# Altium project candy-f1c100s.PrjPcb
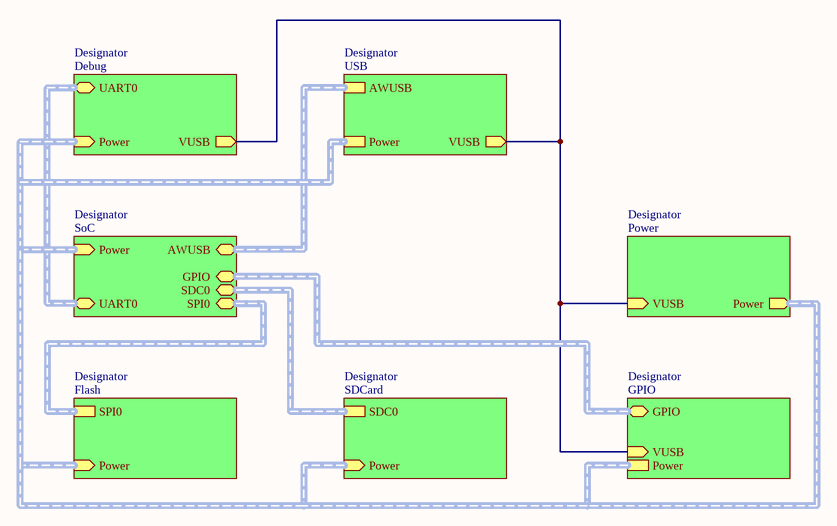
[diagram p0: top.SchDoc]
8 sheets, 96 parts. Net scope: hierarchical (ports join the sheet entries above them; power ports are global).
Board files: candy.PcbDoc, candy-v1.0-product.PcbDoc
Sheets:
  top.SchDoc
    Designator = soc.SchDoc
    Designator = power.SchDoc
    Designator = usb.SchDoc
    Designator = flash.SchDoc
    Designator = sdcard.SchDoc
    Designator = gpio.SchDoc
    Designator = debug.SchDoc

## Sheet top.SchDoc
size A4; SheetNumber: 1; SheetTotal: 8

### Sub-sheets
Designator = SoC: SDC0 (bidir, harness SDC0), SPI0 (bidir, harness SPI0), AWUSB (bidir, harness AWUSB), Power (in, harness Power), GPIO (bidir), UART0 (bidir)
Designator = Power: Power (out, harness Power), VUSB (in)
Designator = USB: AWUSB (harness AWUSB), VUSB (out), Power
Designator = Flash: SPI0 (harness SPI0), Power (in, harness Power)
Designator = SDCard: SDC0 (harness SDC0), Power (in, harness Power)
Designator = GPIO: GPIO (bidir), Power (harness Power), VUSB (in)
Designator = Debug: Power (in), UART0 (bidir), VUSB (out)

### Nets
5V: sheet Designator/VUSB, sheet Designator/VUSB, sheet Designator/VUSB, sheet Designator/VUSB

## Sheet soc.SchDoc
size A3; SheetNumber: 2; SheetTotal: 8
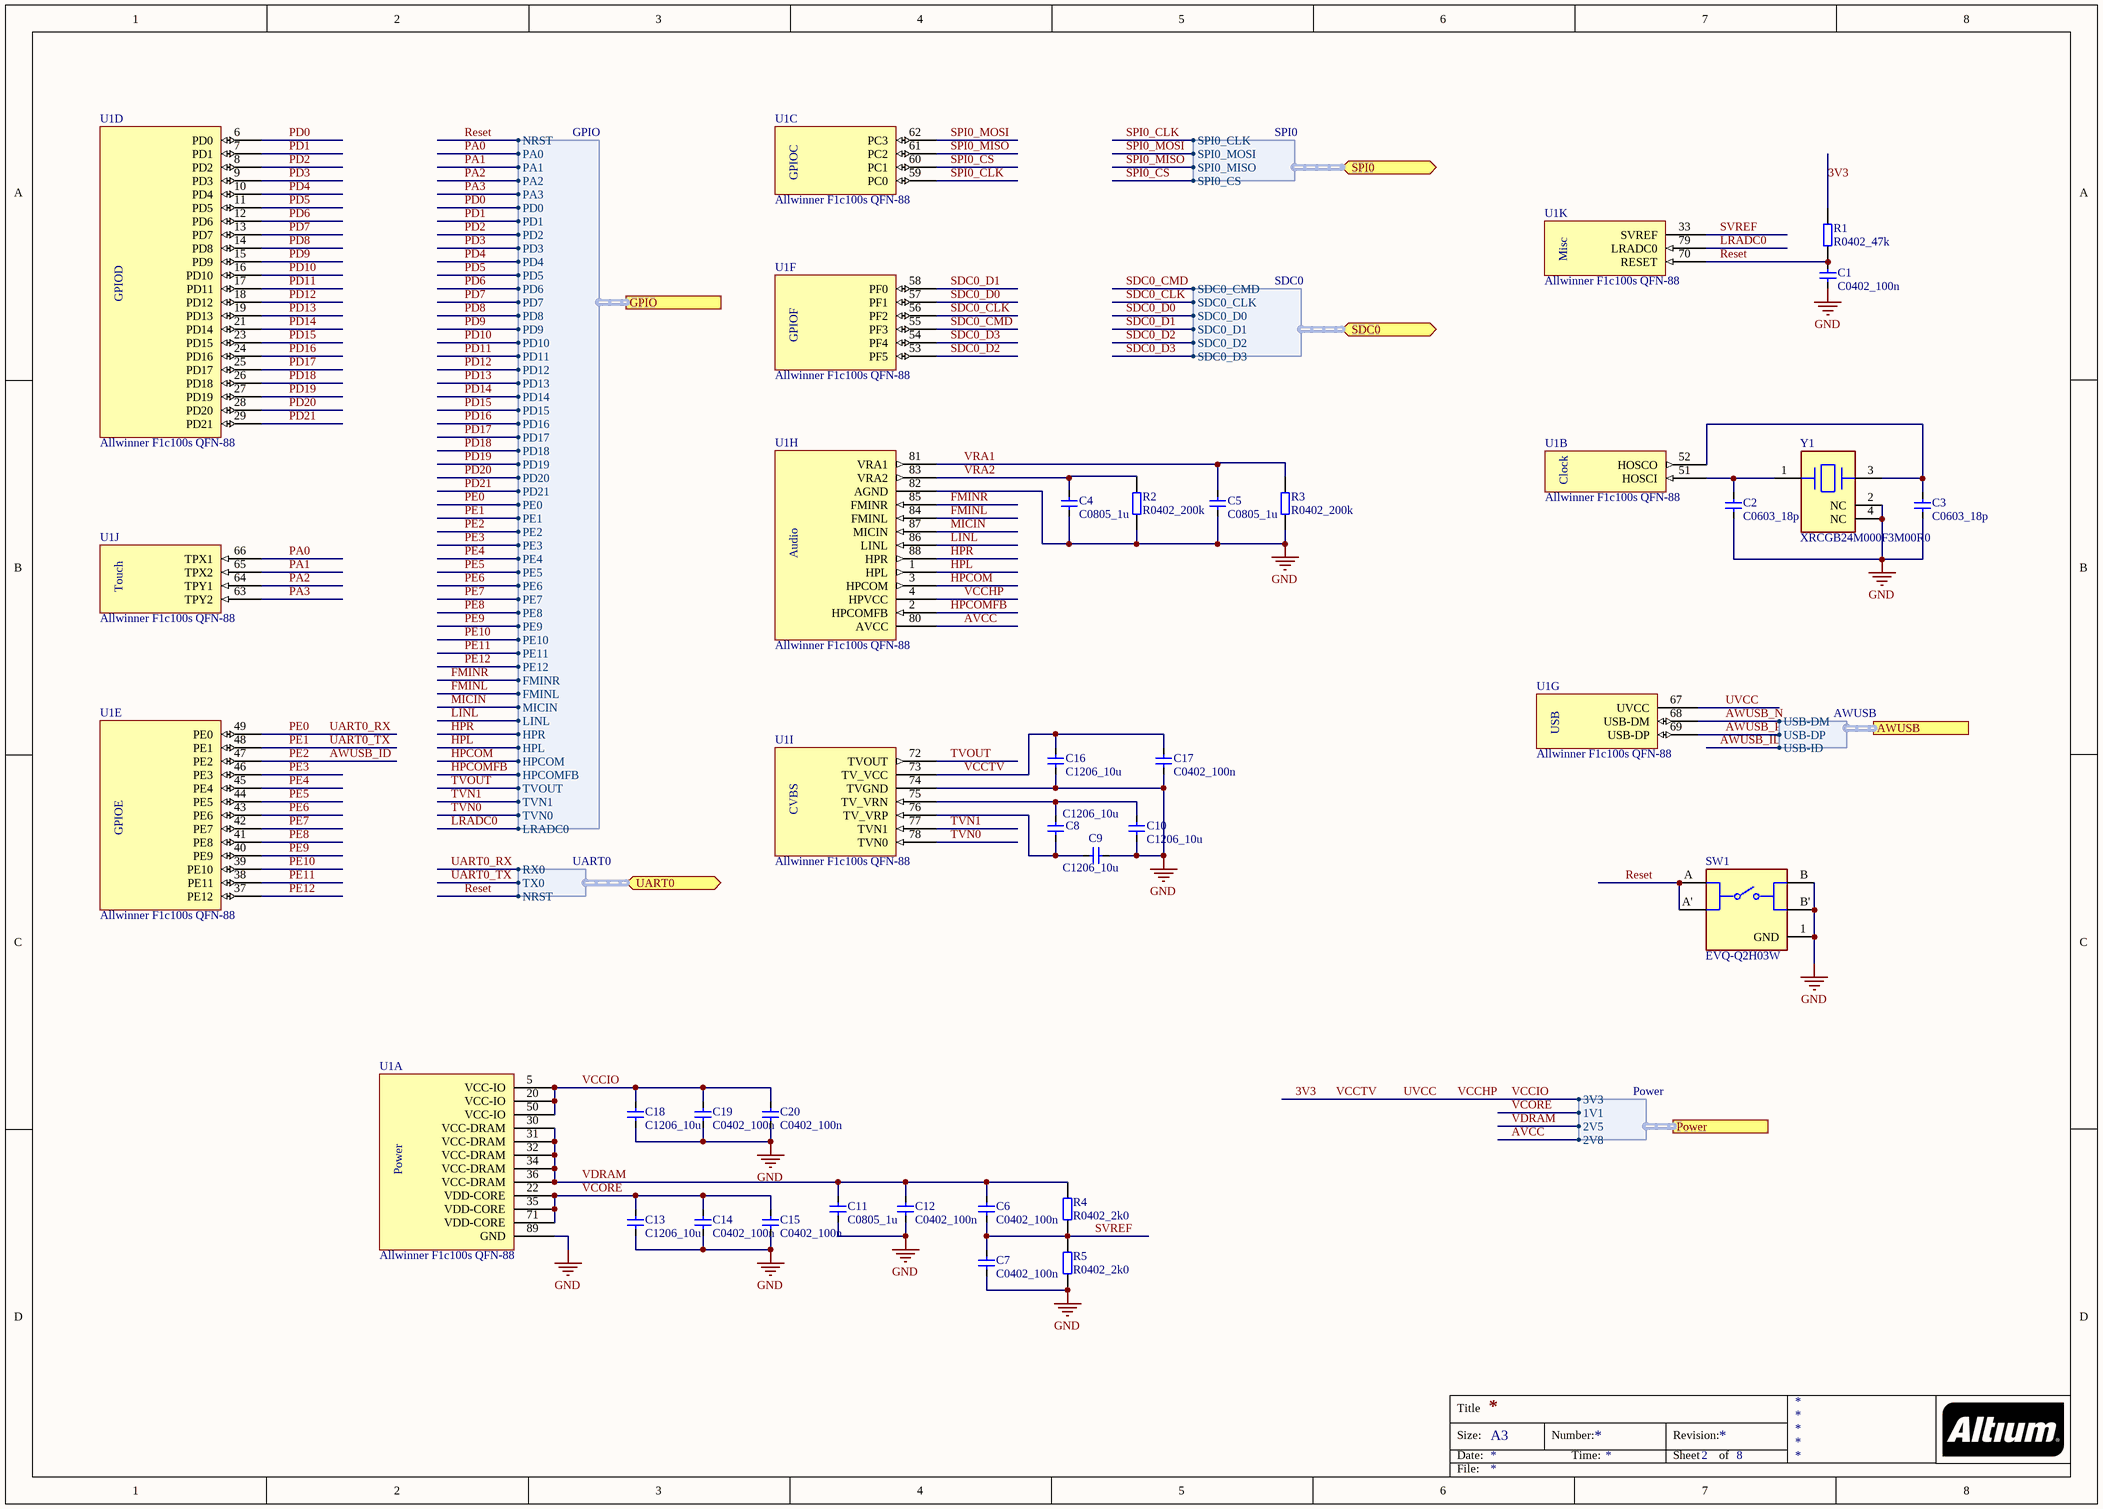
[diagram p1: soc.SchDoc]

### Parts
C1  C0402_100n  [C0402]
C2  C0603_18p  [C0603]
C3  C0603_18p  [C0603]
C4  C0805_1u  [C0805]
C5  C0805_1u  [C0805]
C6  C0402_100n  [C0402]
C7  C0402_100n  [C0402]
C8  C1206_10u  [C1206]
C9  C1206_10u  [C1206]
C10  C1206_10u  [C1206]
C11  C0805_1u  [C0805]
C12  C0402_100n  [C0402]
C13  C1206_10u  [C1206]
C14  C0402_100n  [C0402]
C15  C0402_100n  [C0402]
C16  C1206_10u  [C1206]
C17  C0402_100n  [C0402]
C18  C1206_10u  [C1206]
C19  C0402_100n  [C0402]
C20  C0402_100n  [C0402]
R1  R0402_47k  [R0402]
R2  R0402_200k  [R0402]
R3  R0402_200k  [R0402]
R4  R0402_2k0  [R0402]
R5  R0402_2k0  [R0402]
SW1  EVQ-Q2H03W  [FP-EVQ-Q2H03W-MFG]
U1  Allwinner F1c100s QFN-88  [QFN40P1000X1000X90_HS-89M]  (parts A,B,C,D,E,F,G,H,I,J,K of 11)
Y1  XRCGB24M000F3M00R0  [FP-XRCGB_F_N-MFG]

### Ports
AWUSB (harness AWUSB), GPIO (harness GPIO), Power (harness Power), SDC0 (bidir, harness SDC0), SPI0 (bidir, harness SPI0), UART0 (bidir, harness UART0)

### Harnesses
Power: 3V3, 1V1, 2V5, 2V8
AWUSB: USB-DM, USB-DP, USB-ID
SDC0: SDC0_D0, SDC0_D1, SDC0_D2, SDC0_D3, SDC0_CMD, SDC0_CLK
SPI0: SPI0_CLK, SPI0_MOSI, SPI0_MISO, SPI0_CS
UART0: RX0, TX0, NRST
GPIO: PA0, PA1, PA2, PA3, PD0, PD1, PD2, PD3, PD4, PD5, PD6, PD7, PD8, PD9, PD10, PD11, PD12, PD13, PD14, PD15, PD16, PD17, PD18, PD19, PD20, PD21, PE0, PE1, PE2, PE3, PE4, PE5, PE6, PE7, PE8, PE9, PE10, PE11, PE12, NRST, FMINR, FMINL, MICIN, LINL, HPR, HPL, HPCOM, HPCOMFB, TVOUT, TVN0, TVN1, LRADC0

### Nets
GND: C1.2 C2.2 C3.2 C4.2 C5.2 C7.2 C9.2 C10.2 C11.2 C12.2 C13.2 C14.2 C15.2 C16.2 C17.2 C18.2 C19.2 C20.2 R2.1 R3.1 R5.2 SW1.1(GND) SW1.B SW1.B' U1.74(TVGND) U1.82(AGND) U1.89(GND) Y1.2(NC) Y1.4(NC)
3V3: C16.1 C17.1 C18.1 C19.1 C20.1 R1.2 U1.4(HPVCC) U1.5(VCC-IO) U1.20(VCC-IO) U1.50(VCC-IO) U1.67(UVCC) U1.73(TV_VCC) ; port Power.3V3  [also labelled UVCC, VCCHP, VCCIO, VCCTV]
AVCC: U1.80(AVCC) ; port Power.2V8  [project net 2V8]
AWUSB_ID: U1.47(PE2) ; port AWUSB.USB-ID, port GPIO.PE2  [also labelled PE2]
AWUSB_N: U1.68(USB-DM) ; port AWUSB.USB-DM
AWUSB_P: U1.69(USB-DP) ; port AWUSB.USB-DP
FMINL: U1.84(FMINL) ; port GPIO.FMINL
FMINR: U1.85(FMINR) ; port GPIO.FMINR
HPCOM: U1.3(HPCOM) ; port GPIO.HPCOM
HPCOMFB: U1.2(HPCOMFB) ; port GPIO.HPCOMFB
HPL: U1.1(HPL) ; port GPIO.HPL
HPR: U1.88(HPR) ; port GPIO.HPR
LINL: U1.86(LINL) ; port GPIO.LINL
LRADC0: U1.79(LRADC0) ; port GPIO.LRADC0
MICIN: U1.87(MICIN) ; port GPIO.MICIN
PA0: U1.66(TPX1) ; port GPIO.PA0
PA1: U1.65(TPX2) ; port GPIO.PA1
PA2: U1.64(TPY1) ; port GPIO.PA2
PA3: U1.63(TPY2) ; port GPIO.PA3
PD0: U1.6(PD0) ; port GPIO.PD0
PD1: U1.7(PD1) ; port GPIO.PD1
PD2: U1.8(PD2) ; port GPIO.PD2
PD3: U1.9(PD3) ; port GPIO.PD3
PD4: U1.10(PD4) ; port GPIO.PD4
PD5: U1.11(PD5) ; port GPIO.PD5
PD6: U1.12(PD6) ; port GPIO.PD6
PD7: U1.13(PD7) ; port GPIO.PD7
PD8: U1.14(PD8) ; port GPIO.PD8
PD9: U1.15(PD9) ; port GPIO.PD9
PD10: U1.16(PD10) ; port GPIO.PD10
PD11: U1.17(PD11) ; port GPIO.PD11
PD12: U1.18(PD12) ; port GPIO.PD12
PD13: U1.19(PD13) ; port GPIO.PD13
PD14: U1.21(PD14) ; port GPIO.PD14
PD15: U1.23(PD15) ; port GPIO.PD15
PD16: U1.24(PD16) ; port GPIO.PD16
PD17: U1.25(PD17) ; port GPIO.PD17
PD18: U1.26(PD18) ; port GPIO.PD18
PD19: U1.27(PD19) ; port GPIO.PD19
PD20: U1.28(PD20) ; port GPIO.PD20
PD21: U1.29(PD21) ; port GPIO.PD21
PE0: U1.49(PE0) ; port UART0.RX0, port GPIO.PE0  [also labelled UART0_RX]  [project net CP2102_TXD]
PE1: U1.48(PE1) ; port UART0.TX0, port GPIO.PE1  [also labelled UART0_TX]  [project net CP2102_RXD]
PE3: U1.46(PE3) ; port GPIO.PE3
PE4: U1.45(PE4) ; port GPIO.PE4
PE5: U1.44(PE5) ; port GPIO.PE5
PE6: U1.43(PE6) ; port GPIO.PE6
PE7: U1.42(PE7) ; port GPIO.PE7
PE8: U1.41(PE8) ; port GPIO.PE8
PE9: U1.40(PE9) ; port GPIO.PE9
PE10: U1.39(PE10) ; port GPIO.PE10
PE11: U1.38(PE11) ; port GPIO.PE11
PE12: U1.37(PE12) ; port GPIO.PE12
Reset: C1.1 R1.1 SW1.A SW1.A' U1.70(RESET) ; port UART0.NRST, port GPIO.NRST  [project net CP2102_DTR]
SDC0_CLK: U1.56(PF2) ; port SDC0.SDC0_CLK
SDC0_CMD: U1.55(PF3) ; port SDC0.SDC0_CMD
SDC0_D0: U1.57(PF1) ; port SDC0.SDC0_D0
SDC0_D1: U1.58(PF0) ; port SDC0.SDC0_D1
SDC0_D2: U1.53(PF5) ; port SDC0.SDC0_D2
SDC0_D3: U1.54(PF4) ; port SDC0.SDC0_D3
SPI0_CLK: U1.59(PC0) ; port SPI0.SPI0_CLK
SPI0_CS: U1.60(PC1) ; port SPI0.SPI0_CS
SPI0_MISO: U1.61(PC2) ; port SPI0.SPI0_MISO
SPI0_MOSI: U1.62(PC3) ; port SPI0.SPI0_MOSI
SVREF: C6.2 C7.1 R4.2 R5.1 U1.33(SVREF)
TVN0: U1.78(TVN0) ; port GPIO.TVN0
TVN1: U1.77(TVN1) ; port GPIO.TVN1
TVOUT: U1.72(TVOUT) ; port GPIO.TVOUT
VCORE: C13.1 C14.1 C15.1 U1.22(VDD-CORE) U1.35(VDD-CORE) U1.71(VDD-CORE) ; port Power.1V1  [project net 1V1]
VDRAM: C6.1 C11.1 C12.1 R4.1 U1.30(VCC-DRAM) U1.31(VCC-DRAM) U1.32(VCC-DRAM) U1.34(VCC-DRAM) U1.36(VCC-DRAM) ; port Power.2V5  [project net 2V5]
VRA1: C5.1 R3.2 U1.81(VRA1)
VRA2: C4.1 R2.2 U1.83(VRA2)
NetC2_1: C2.1 U1.51(HOSCI) Y1.1(1_Input/Output)
NetC3_1: C3.1 U1.52(HOSCO) Y1.3(2_Input/Output)
NetC8_1: C8.1 C10.1 U1.75(TV_VRN)
NetC8_2: C8.2 C9.1 U1.76(TV_VRP)

### Notes on the sheet
- Title
- Size:
- Date:
- A3
- Number:
- Time:
- Revision:
- Sheet
- of
- File:
- (in symbol CMP-00002-1, part A) Power
- (in symbol CMP-00002-1, part B) Clock
- (in symbol CMP-00002-1, part C) GPIOC
- (in symbol CMP-00002-1, part D) GPIOD
- (in symbol CMP-00002-1, part E) GPIOE
- (in symbol CMP-00002-1, part F) GPIOF
- (in symbol CMP-00002-1, part G) USB
- (in symbol CMP-00002-1, part H) Audio
- (in symbol CMP-00002-1, part I) CVBS
- (in symbol CMP-00002-1, part J) Touch
- (in symbol CMP-00002-1, part K) Misc

### Library data of the parts
C1 C6 C7 C12 C14 C15 C17 C19 C20 = CMP-003-0006-1: Manufacturer 1: Kemet; Manufacturer Part Number 1: C0402C104K4RACTU; Dielectric: X7R; Voltage Rating DC: 16V; Value: 100n; Tolerance: 0.1%; Part Number: C0402_100n; Pin Count: 2; Component Type: Standard
C2 C3 = CMP-003-0024-1: Manufacturer Part Number 1: C0603C180J1GAC; Manufacturer 1: Kemet; Tolerance: 0.05%; Hidden Value: C180; Voltage Rating DC: 100V; Dielectric: C0G; Value: 18p; Part Number: C0603_18p; Pin Count: 2; Component Type: Standard
C4 C5 C11 = CMP-003-0085-1: Manufacturer 1: Kemet; Manufacturer Part Number 1: C0805C105K3RAC; Voltage Rating DC: 25V; Dielectric: X7R; Hidden Value: C105; Tolerance: 0.1%; Value: 1u; Component Type: Standard; Pin Count: 2; Part Number: C0805_1u
C8-C10 C13 C16 C18 = CMP-003-0097-1: Manufacturer 1: Kemet; Manufacturer Part Number 1: C1206C106K4RAC; Value: 10u; Hidden Value: C106; Tolerance: 0.1%; Dielectric: X7R; Voltage Rating DC: 16V; Part Number: C1206_10u; Pin Count: 2; Component Type: Standard
R1 = CMP-004-0459-1: Manufacturer Part Number 1: CRCW040247K0FKED; Manufacturer 1: Vishay; Power Rating: 62,5mW; Tolerance: 1%; Value: 47k; Part Number: R0402_47k; Component Type: Standard; Pin Count: 2
R2 R3 = CMP-004-0474-1: Manufacturer Part Number 1: CRCW0402200KFKED; Manufacturer 1: Vishay; Tolerance: 1%; Power Rating: 62,5mW; Value: 200k; Pin Count: 2; Component Type: Standard; Part Number: R0402_200k
R4 R5 = CMP-004-0426-1: Manufacturer 1: Vishay; Manufacturer Part Number 1: CRCW04022K00FKED; Tolerance: 1%; Power Rating: 62,5mW; Value: 2k0; Component Type: Standard; Pin Count: 2; Part Number: R0402_2k0
SW1 = CMP-05618-000002-1: SWITCH TACTILE SPST-NO 0.02A 15V; Manufacturer: Panasonic Electronic Components; Electromechanical Life: 1000000Cycles; Contact Current Rating: 20mA; Contact Resistance: 100mΩ; Operating Force: 1N; Height: 3.3mm; ComponentLink2URL: https://industrial.panasonic.com/ac/cdn/e/control/switch/light-touch/catalog/sw_lt_eng_6s_th.pdf; Category: Switch; Mouser Description: Switch Tactile ON OFF SPST Round Button J-Bend 0.02A 15VDC 1N SMD Embossed T/R; Mount: Surface Mount; Temperature: -40°C to +85°C; Throw Configuration: SPST-NO; Digikey Description: SWITCH TACTILE SPST-NO 0.02A 15V; Device Class L1: Electromechanical; ComponentLink2Description: Datasheet; Manufacturer Part Number: EVQ-Q2H03W; Device Class L3: Tactile Switches; RoHS: TRUE; Device Class L2: Switches; Temperature Range High: +85°C; Temperature Range Low: -40°C; Octopart: https://octopart.com/evq-q2h03w-panasonic-1368538; Voltage Rating Dc: 15V; Package: 0; Automotive: No; Lead Free: Yes
U1 = CMP-00002-1
Y1 = CMP-06054-000017-1: CRYSTAL 24.0000MHZ 6PF SMD; ESR (Equivalent Series Resistance): 150R; Operating Frequency: 24 MHz; Tolerance: 30ppm; Frequency: 24MHz; Frequency Stability: 40ppm; Length: 2mm; Height: 0.028inch; Lead Free: Lead Free; Min Operating Temperature: -30°C; REACH SVHC: No SVHC; RoHS Compliant: Yes; Series Resistance: 150R; Mount: Surface Mount; Packaging: Tape and Reel; Termination: SMD/SMT; Case/Package: SMD/SMT; Max Operating Temperature: 85°C; Width: 1.6mm; Number of Pins: 4; Load Capacitance: 6pF; Package Quantity: 1; Depth: 1.6mm; Frequency Tolerance: 30ppm; Series: XRCGB

## Sheet power.SchDoc
size A4; Organization: Altium Limited; Address1: L3, 12a Rodborough Rd; Address2: Frenchs Forest; Address3: NSW; Address4: Australia 2086; SheetNumber: 6; SheetTotal: 8
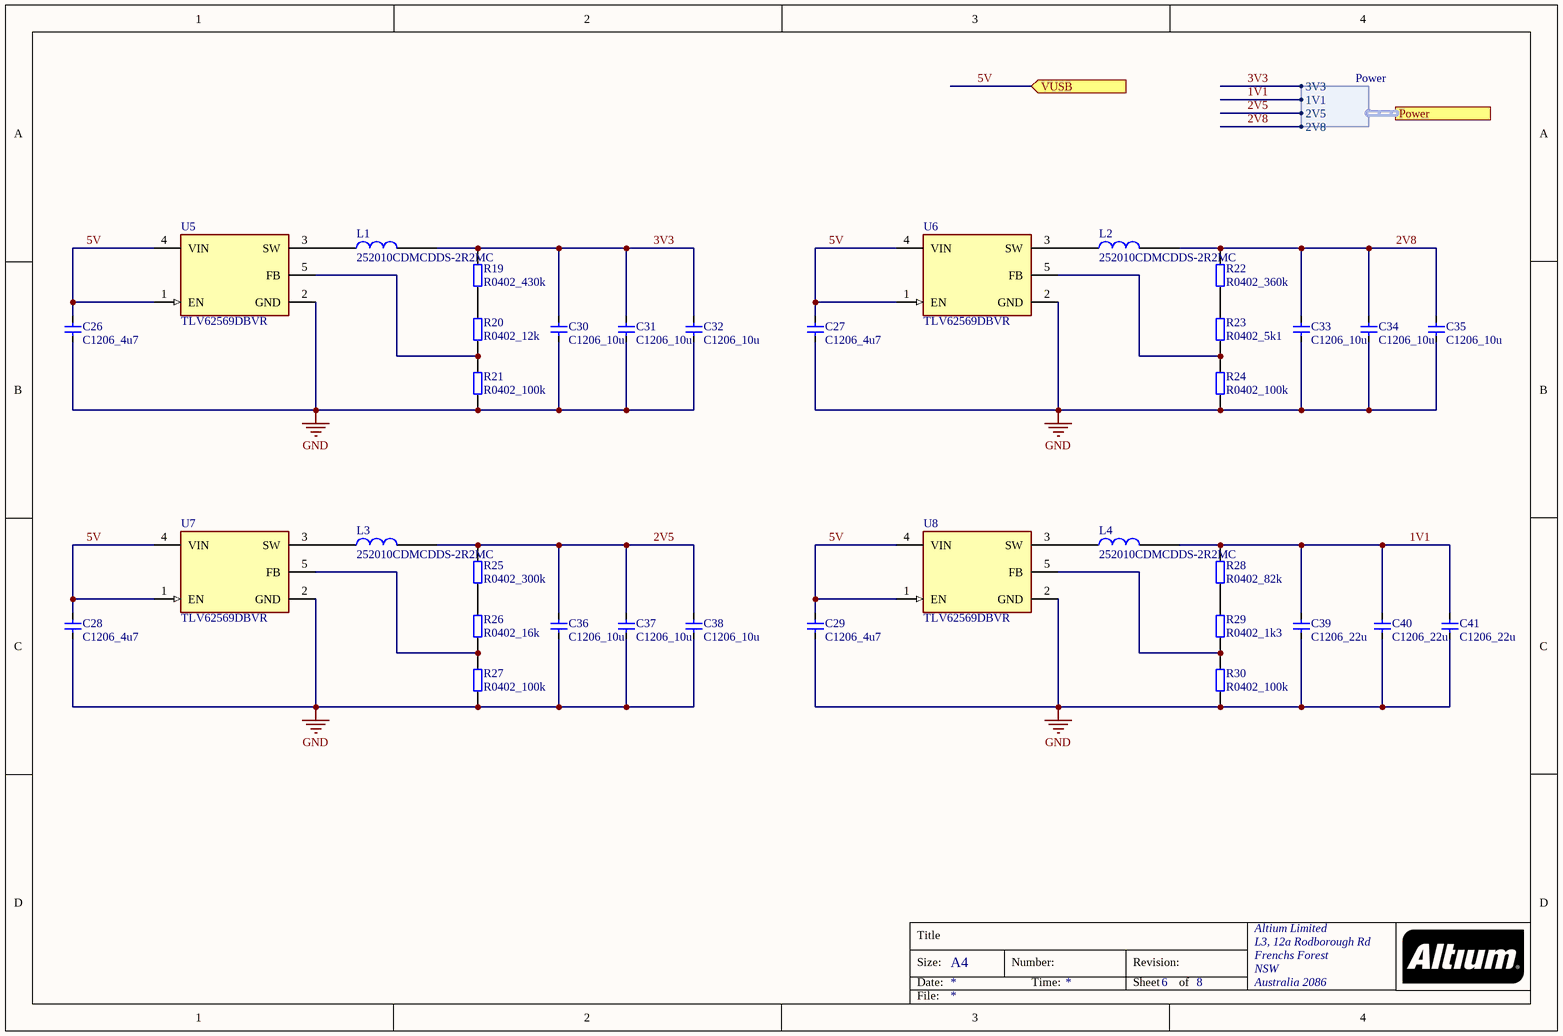
[diagram p2: power.SchDoc]

### Parts
C26  C1206_4u7  [C1206]
C27  C1206_4u7  [C1206]
C28  C1206_4u7  [C1206]
C29  C1206_4u7  [C1206]
C30  C1206_10u  [C1206]
C31  C1206_10u  [C1206]
C32  C1206_10u  [C1206]
C33  C1206_10u  [C1206]
C34  C1206_10u  [C1206]
C35  C1206_10u  [C1206]
C36  C1206_10u  [C1206]
C37  C1206_10u  [C1206]
C38  C1206_10u  [C1206]
C39  C1206_22u  [C1206]
C40  C1206_22u  [C1206]
C41  C1206_22u  [C1206]
L1  252010CDMCDDS-2R2MC  [INDC2520X10N]
L2  252010CDMCDDS-2R2MC  [INDC2520X10N]
L3  252010CDMCDDS-2R2MC  [INDC2520X10N]
L4  252010CDMCDDS-2R2MC  [INDC2520X10N]
R19  R0402_430k  [R0402]
R20  R0402_12k  [R0402]
R21  R0402_100k  [R0402]
R22  R0402_360k  [R0402]
R23  R0402_5k1  [R0402]
R24  R0402_100k  [R0402]
R25  R0402_300k  [R0402]
R26  R0402_16k  [R0402]
R27  R0402_100k  [R0402]
R28  R0402_82k  [R0402]
R29  R0402_1k3  [R0402]
R30  R0402_100k  [R0402]
U5  TLV62569DBVR  [FP-DBV0005A-MFG]
U6  TLV62569DBVR  [FP-DBV0005A-MFG]
U7  TLV62569DBVR  [FP-DBV0005A-MFG]
U8  TLV62569DBVR  [FP-DBV0005A-MFG]

### Ports
Power (harness Power), VUSB (in)

### Harnesses
Power: 3V3, 1V1, 2V5, 2V8

### Nets
5V: C26.1 C27.1 C28.1 C29.1 U5.1(EN) U5.4(VIN) U6.1(EN) U6.4(VIN) U7.1(EN) U7.4(VIN) U8.1(EN) U8.4(VIN) ; port VUSB
GND: C26.2 C27.2 C28.2 C29.2 C30.2 C31.2 C32.2 C33.2 C34.2 C35.2 C36.2 C37.2 C38.2 C39.2 C40.2 C41.2 R21.1 R24.1 R27.1 R30.1 U5.2(GND) U6.2(GND) U7.2(GND) U8.2(GND)
1V1: C39.1 C40.1 C41.1 L4.2 R28.2 ; port Power.1V1
2V5: C36.1 C37.1 C38.1 L3.2 R25.2 ; port Power.2V5
2V8: C33.1 C34.1 C35.1 L2.2 R22.2 ; port Power.2V8
3V3: C30.1 C31.1 C32.1 L1.2 R19.2 ; port Power.3V3
NetL1_1: L1.1 U5.3(SW)
NetL2_1: L2.1 U6.3(SW)
NetL3_1: L3.1 U7.3(SW)
NetL4_1: L4.1 U8.3(SW)
NetR19_1: R19.1 R20.2
NetR20_1: R20.1 R21.2 U5.5(FB)
NetR22_1: R22.1 R23.2
NetR23_1: R23.1 R24.2 U6.5(FB)
NetR25_1: R25.1 R26.2
NetR26_1: R26.1 R27.2 U7.5(FB)
NetR28_1: R28.1 R29.2
NetR29_1: R29.1 R30.2 U8.5(FB)

### Notes on the sheet
- Title
- Size:
- Date:
- A4
- Number:
- Time:
- Revision:
- Sheet
- of
- File:

### Library data of the parts
C26-C29 = CMP-003-0093-1: Manufacturer 1: Kemet; Manufacturer Part Number 1: C1206C475K4RAC; Voltage Rating DC: 16V; Dielectric: X7R; Tolerance: 0.1%; Hidden Value: C475; Value: 4u7; Component Type: Standard; Part Number: C1206_4u7; Pin Count: 2
C30-C38 = CMP-003-0097-1: as C8 on sheet soc; Part Number: C1206_10u; Pin Count: 2; Component Type: Standard
C39-C41 = CMP-003-0098-1: Manufacturer 1: Kemet; Manufacturer Part Number 1: C1206C226M8PAC; Hidden Value: C226; Dielectric: X5R; Tolerance: 0.2%; Voltage Rating DC: 10V; Value: 22u; Pin Count: 2; Part Number: C1206_22u; Component Type: Standard
L1-L4 = CMP-00003-2: Fixed Ind 2.2UH 2.5A 97 Mohm SMD
R19 = CMP-004-0482-1: Manufacturer Part Number 1: CRCW0402430KFKED; Manufacturer 1: Vishay; Tolerance: 1%; Value: 430k; Power Rating: 62,5mW; Component Type: Standard; Pin Count: 2; Part Number: R0402_430k
R20 = CMP-004-0445-1: Manufacturer 1: Vishay; Manufacturer Part Number 1: CRCW040212K0FKED; Power Rating: 62,5mW; Value: 12k; Tolerance: 1%; Part Number: R0402_12k; Component Type: Standard; Pin Count: 2
R21 R24 R27 R30 = CMP-004-0467-1: Manufacturer Part Number 1: CRCW0402100KFKED; Manufacturer 1: Vishay; Tolerance: 1%; Value: 100k; Power Rating: 62,5mW; Component Type: Standard; Part Number: R0402_100k; Pin Count: 2
R22 = CMP-004-0480-1: Manufacturer 1: Vishay; Manufacturer Part Number 1: CRCW0402360KFKED; Power Rating: 62,5mW; Tolerance: 1%; Value: 360k; Pin Count: 2; Component Type: Standard; Part Number: R0402_360k
R23 = CMP-004-0436-1: Manufacturer 1: Vishay; Manufacturer Part Number 1: CRCW04025K10FKED; Value: 5k1; Tolerance: 1%; Power Rating: 62,5mW; Pin Count: 2; Component Type: Standard; Part Number: R0402_5k1
R25 = CMP-004-0478-1: Manufacturer 1: Vishay; Manufacturer Part Number 1: CRCW0402300KFKED; Power Rating: 62,5mW; Tolerance: 1%; Value: 300k; Pin Count: 2; Component Type: Standard; Part Number: R0402_300k
R26 = CMP-004-0448-1: Manufacturer Part Number 1: CRCW040216K0FKED; Manufacturer 1: Vishay; Power Rating: 62,5mW; Tolerance: 1%; Value: 16k; Part Number: R0402_16k; Component Type: Standard; Pin Count: 2
R28 = CMP-004-0465-1: Manufacturer 1: Vishay; Manufacturer Part Number 1: CRCW040282K0FKED; Power Rating: 62,5mW; Value: 82k; Tolerance: 1%; Component Type: Standard; Pin Count: 2; Part Number: R0402_82k
R29 = CMP-004-0422-1: Manufacturer Part Number 1: CRCW04021K30FKED; Manufacturer 1: Vishay; Tolerance: 1%; Value: 1k3; Power Rating: 62,5mW; Pin Count: 2; Part Number: R0402_1k3; Component Type: Standard
U5-U8 = CMP-04918-000387-1: IC REG BUCK ADJ 2A SOT23-5; Output Configuration: Positive; Min Output Voltage: 600mV; Max Output Voltage: 5.5V; Switching Frequency: 1.5MHz; Output Type: Adjustable; Synchronous Rectifier: Yes; Min Input Voltage: 2.5V; Output Current: 2A; Mount: Surface Mount; Min Operating Temperature: -40°C; Max Operating Temperature: 125°C; RoHS Compliant: Yes; Max Input Voltage: 5.5V; Case/Package: SOT-23-5; Packaging: Cut Tape

## Sheet usb.SchDoc
size A4; SheetNumber: 4; SheetTotal: 8
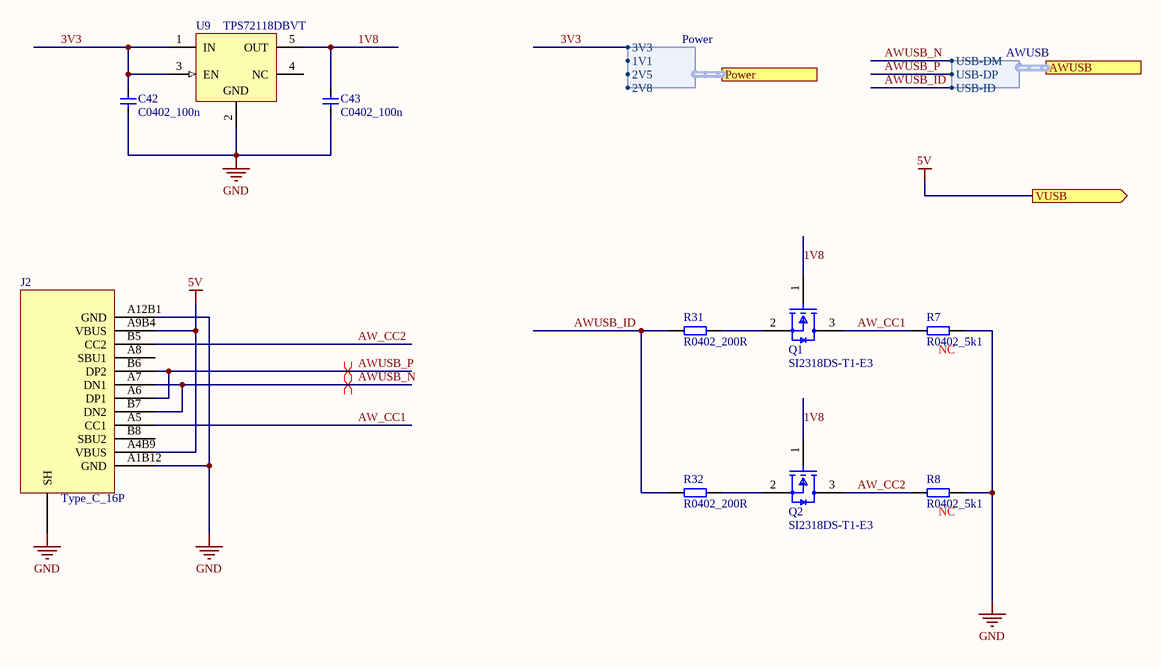
[diagram p3: usb.SchDoc]

### Parts
C42  C0402_100n  [C0402]
C43  C0402_100n  [C0402]
J2  Type_C_16P  [Type_C_16P]
Q1  SI2318DS-T1-E3  [FP-S-03946-MFG]
Q2  SI2318DS-T1-E3  [FP-S-03946-MFG]
R7  R0402_5k1  [R0402]
R8  R0402_5k1  [R0402]
R31  R0402_200R  [R0402]
R32  R0402_200R  [R0402]
U9  TPS72118DBVT  [DBV0005A_L]

### Ports
AWUSB (harness AWUSB), Power (harness Power), VUSB (out)

### Harnesses
AWUSB: USB-DM, USB-DP, USB-ID
Power: 3V3, 1V1, 2V5, 2V8

### Nets
5V: J2.A4B9(VBUS) J2.A9B4(VBUS) ; port VUSB
GND: C42.2 C43.2 J2.0(SH) J2.A1B12(GND) J2.A12B1(GND) R7.2 R8.2 U9.2(GND)
1V8: C43.1 Q1.1(G) Q2.1(G) U9.5(OUT)
3V3: C42.1 U9.1(IN) U9.3(EN) ; port Power.3V3
AW_CC1: J2.A5(CC1) Q1.3(D) R7.1
AW_CC2: J2.B5(CC2) Q2.3(D) R8.1
AWUSB_ID: R31.1 R32.1 ; port AWUSB.USB-ID
AWUSB_N: J2.A7(DN1) J2.B7(DN2) ; port AWUSB.USB-DM
AWUSB_P: J2.A6(DP1) J2.B6(DP2) ; port AWUSB.USB-DP
NetQ1_2: Q1.2(S) R31.2
NetQ2_2: Q2.2(S) R32.2

Not connected (* = marked no-connect by the designer): J2 A8(SBU1) B8(SBU2); U9 4(NC)

### Layout directives
differential pair: AWUSB_N, AWUSB_P

### Notes on the sheet
- (near R7) NC
- (near R8) NC

### Library data of the parts
C42 C43 = CMP-003-0006-1: as C1 on sheet soc; Part Number: C0402_100n; Pin Count: 2; Component Type: Standard
Q1 Q2 = CMP-02550-000015-1: MOSFET N-CH 40V 3A SOT23-3; Manufacturer: Vishay; Input Capacitace At Vds: 540pF @ 20V; Turn On Delay Time: 5ns; Standoff Height: 0.01mm; Rthja Max: 120°C/W; Power Dissipation: 0.75W; Number Of Channels: 1; Max Junction Temp: +150°C; Gate Charge At Vgs: 10nC @ 10V; Pulse Drain Current: 16A; Turn Off Delay Time: 20ns; Threshold Vgs Min: 1V; Depletion Mode: False; Max Forward Diode Voltage: 1.2V; Drain To Source Resistance: 0.036Ω; Gate To Source Voltage: 20V; Transconductance: 11S; Threshold Vgs Max: 3V; Typ Forward Diode Voltage: 0.8V; Lead Free: Yes; Temperature Range Low: -55°C; Drain To Source Voltage: 40V; Category: Trans; Number Of N Channels: 1; Temperature Range High: +150°C; RoHS: TRUE; Digikey Description: MOSFET N-CH 40V 3A SOT23-3; Mouser Description: MOSFET 40V 6A; Manufacturer Part Number: SI2318DS-T1-E3; Drain To Source Breakdown Voltage: 40V; ComponentLink2Description: Datasheet; Device Class L1: Discrete Semiconductors; Temperature: -55°C to +150°C; Automotive: No; Package: S-03946; Device Class L3: MOSFETs; Height: 1.12mm; Octopart: https://octopart.com/si2318ds-t1-e3-vishay-40866469; Continuous Drain Current: 3A; Device Class L2: Transistors; ComponentLink2URL: http://www.vishay.com/docs/72322/72322.pdf
R7 R8 = CMP-004-0436-1: as R23 on sheet power; Pin Count: 2; Component Type: Standard; Part Number: R0402_5k1
R31 R32 = CMP-004-0402-1: Manufacturer 1: Vishay; Manufacturer Part Number 1: CRCW0402200RFKED; Tolerance: 1%; Value: 200R; Power Rating: 62,5mW; Part Number: R0402_200R; Pin Count: 2; Component Type: Standard
U9 = CMP-0394-00587-2: Single Output Low Input Voltage Requirement LDO, 150 mA, Fixed 1.8 V Output, 1.8 to 5.5 V Input, with Low IQ, 5-pin SOT-23 (DBV), -40 to 125 degC, Green (RoHS & no Sb/Br); Manufacturer: Texas Instruments; Vout Adj(Min)(V): 1.8; Vdo(Typ)(mV): 150; Vin(Max)(V): 5.5; Accuracy(%): 3; SubFamily: Single Channel LDO; Iout(Max)(A): 0.1; Iq(Typ)(mA): 0.57; PartNumber: TPS72118DBVT; ComponentLink2Description: Datasheet; ComponentLink3Description: Package Specification; Eco-Plan: Green (RoHS & no Sb/Br); ComponentLink2URL: http://www.ti.com/general/docs/lit/getliterature.tsp?genericPartNumber=TPS72118&fileType=pdf; Vout Adj(Max)(V): 1.8; Mounting Technology: Surface Mount; ComponentLink1Description: Manufacturer URL; DatasheetVersion: SLVS352C; ComponentLink3URL: http://www.ti.com/litv/pdf/mpds018i; Fixed Output Options(V): 1.8; PackageReference: DBV0005A; PackageVersion: 4073253-4/K; PackageDescription: 5-Pin Plastic Small Outline, Body 1.60 Ãƒâ€” 2.90 mm, Pitch 0.95 mm; Vin(Min)(V): 1.8; Code_JEDEC: MO-178; ComponentLink1URL: http://www.ti.com/

## Sheet flash.SchDoc
size A4; SheetNumber: 5; SheetTotal: 7
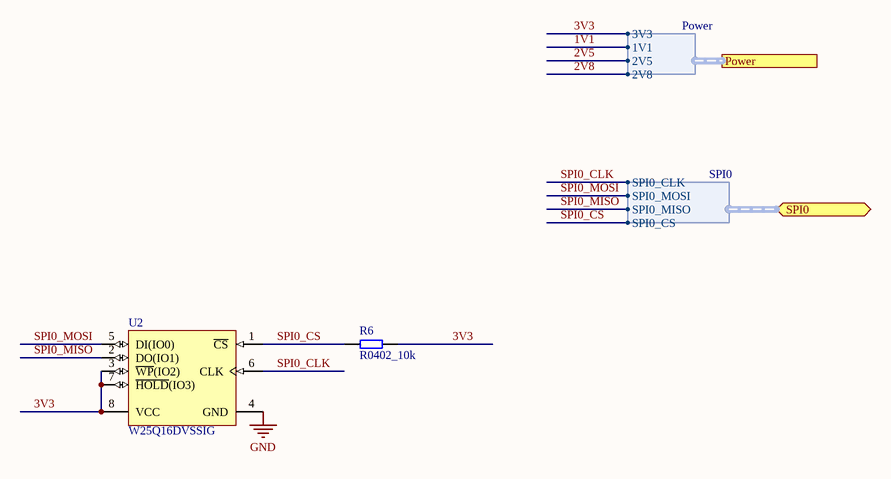
[diagram p4: flash.SchDoc]

### Parts
R6  R0402_10k  [R0402]
U2  W25Q16DVSSIG  [WINB-W25Q16DVSSIG-8_M]

### Ports
Power (harness Power), SPI0 (bidir, harness SPI0)

### Harnesses
SPI0: SPI0_CLK, SPI0_MOSI, SPI0_MISO, SPI0_CS
Power: 3V3, 1V1, 2V5, 2V8

### Nets
GND: U2.4(GND)
3V3: R6.2 U2.3(~{WP}(IO2)) U2.7(~{HOLD}(IO3)) U2.8(VCC) ; port Power.3V3
SPI0_CLK: U2.6(CLK) ; port SPI0.SPI0_CLK
SPI0_CS: R6.1 U2.1(~{CS}) ; port SPI0.SPI0_CS
SPI0_MISO: U2.2(DO(IO1)) ; port SPI0.SPI0_MISO
SPI0_MOSI: U2.5(DI(IO0)) ; port SPI0.SPI0_MOSI

### Library data of the parts
R6 = CMP-004-0443-1: Manufacturer 1: Vishay; Manufacturer Part Number 1: CRCW040210K0FKED; Power Rating: 62,5mW; Value: 10k; Tolerance: 1%; Part Number: R0402_10k; Component Type: Standard; Pin Count: 2
U2 = CMP-2000-05434-1: IC FLASH 16MBIT 104MHZ 8SOIC; Manufacturer: Winbond; Interface Type: Serial(SPI); Rad Hardened: No; Programmable: Yes; Supply Current: 18mA; Number of Words: 2M; Density: 16777216Bit; Word Size: 8b; Sync/Async: Synchronous; Cell Type: NOR; Operating Supply Voltage (Min): 2.7V; Boot Type: Bottom/Top; Address Bus: 24b; Program/Erase Volt (Typ): 2.7to3.6V; Access Time (Max): 7ns; Operating Supply Voltage (Max): 3.6V; Operating Supply Voltage (Typ): 3/3.3V; Mounting: SurfaceMount; Datasheet Version: Rev. D, 10/2012; Manufacturer URL: http://www.winbond.com/hq/index.html?__locale=en; Operating Temperature (Min): -40C; Operating Temperature (Max): 85C; Pin Count: 8; Package Type: SOICW; Datasheet URL: https://ciiva.com/datasheet-click-14728450?src=ciiva&sig=bd4f4644; Operating Temp Range: -40Cto85C; Operating Temperature Classification: Industrial

## Sheet sdcard.SchDoc
size A4; SheetNumber: 3; SheetTotal: 7
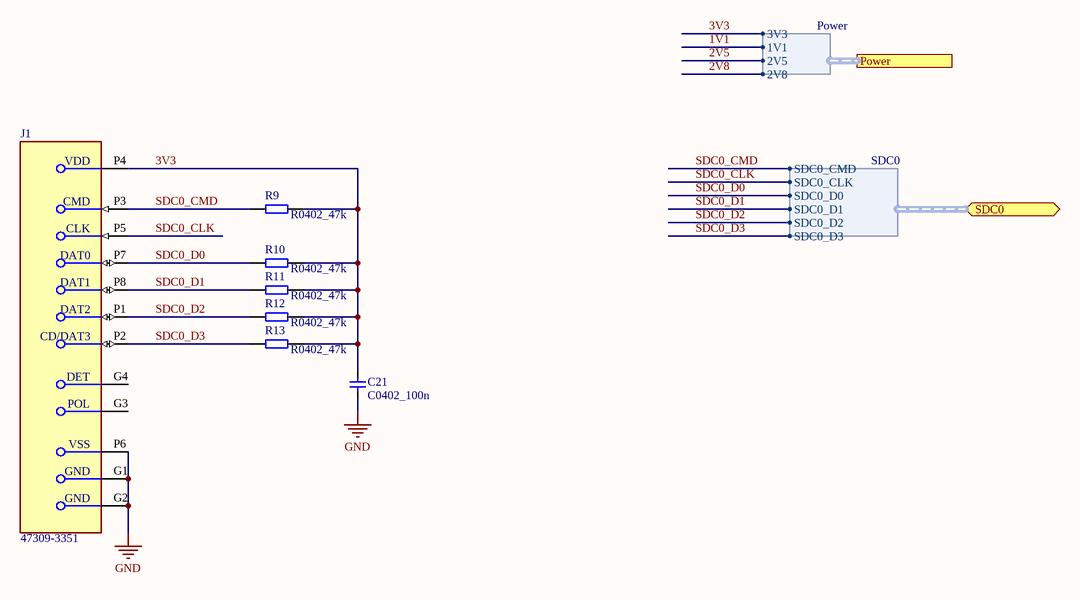
[diagram p5: sdcard.SchDoc]

### Parts
C21  C0402_100n  [C0402]
J1  47309-3351  [FP-47309-3351-MFG]
R9  R0402_47k  [R0402]
R10  R0402_47k  [R0402]
R11  R0402_47k  [R0402]
R12  R0402_47k  [R0402]
R13  R0402_47k  [R0402]

### Ports
Power (harness Power), SDC0 (bidir, harness SDC0)

### Harnesses
SDC0: SDC0_D0, SDC0_D1, SDC0_D2, SDC0_D3, SDC0_CMD, SDC0_CLK
Power: 3V3, 1V1, 2V5, 2V8

### Nets
GND: C21.2 J1.G1(GND) J1.G2(GND) J1.P6(VSS)
3V3: C21.1 J1.P4(VDD) R9.2 R10.2 R11.2 R12.2 R13.2 ; port Power.3V3
SDC0_CLK: J1.P5(CLK) ; port SDC0.SDC0_CLK
SDC0_CMD: J1.P3(CMD) R9.1 ; port SDC0.SDC0_CMD
SDC0_D0: J1.P7(DAT0) R10.1 ; port SDC0.SDC0_D0
SDC0_D1: J1.P8(DAT1) R11.1 ; port SDC0.SDC0_D1
SDC0_D2: J1.P1(DAT2) R12.1 ; port SDC0.SDC0_D2
SDC0_D3: J1.P2(CD/DAT3) R13.1 ; port SDC0.SDC0_D3

Not connected (* = marked no-connect by the designer): J1 G3(POL) G4(DET)

### Library data of the parts
C21 = CMP-003-0006-1: as C1 on sheet soc; Part Number: C0402_100n; Pin Count: 2; Component Type: Standard
J1 = CMP-011-000000-2: CONN MICRO SD CARD PUSH-PULL R/A; Current Rating: 500mA; Number of Circuits: 8; Connector Type: Socket; Insulation Resistance: 100MR; Voltage Rating (DC): 5V; Pitch: 1.1mm; Gender: Female; Max Operating Temperature: 85°C; RoHS Compliant: Yes; Source: sdcard.SchLib; Depth: 3.35mm; Number of Contacts: 8; Mount: Surface Mount; Length: 11.4mm; Design Item ID: CMP-04763-000007-1; Width: 5.5mm; Min Operating Temperature: -40°C; Housing Material: Thermoplastic; Contact Material: Bronze; Number of Rows: 1; Termination: SMD/SMT; Series: 47309; Orientation: Right Angle; Contact Plating: Gold; Halogen Free: Low Halogen; Radiation Hardening: No; Package Quantity: 4200; Packaging: Tape and Reel
R9-R13 = CMP-004-0459-1: as R1 on sheet soc; Part Number: R0402_47k; Component Type: Standard; Pin Count: 2

## Sheet gpio.SchDoc
size A4; Organization: Altium Limited; Address1: L3, 12a Rodborough Rd; Address2: Frenchs Forest; Address3: NSW; Address4: Australia 2086; SheetNumber: 7; SheetTotal: 8
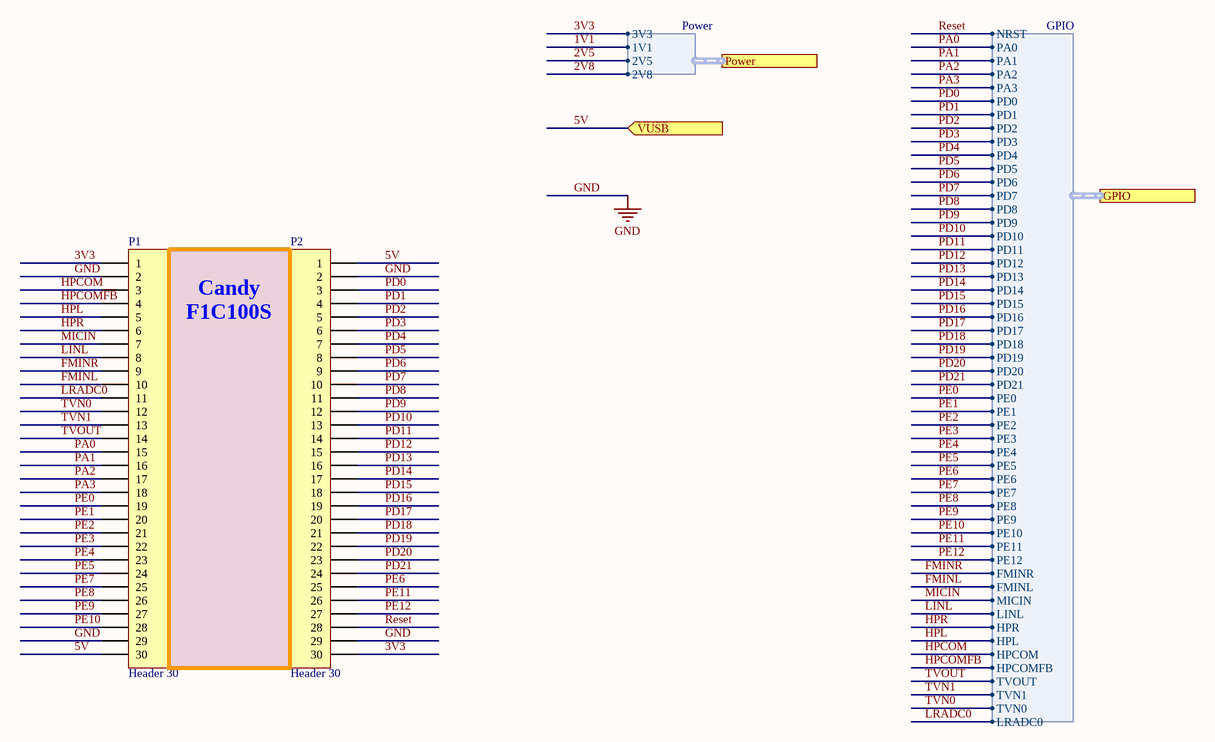
[diagram p6: gpio.SchDoc]

### Parts
P1  Header 30  [HDR1X30]
P2  Header 30  [HDR1X30]

### Ports
GPIO (harness GPIO), Power (harness Power), VUSB (in)

### Harnesses
Power: 3V3, 1V1, 2V5, 2V8
GPIO: PA0, PA1, PA2, PA3, PD0, PD1, PD2, PD3, PD4, PD5, PD6, PD7, PD8, PD9, PD10, PD11, PD12, PD13, PD14, PD15, PD16, PD17, PD18, PD19, PD20, PD21, PE0, PE1, PE2, PE3, PE4, PE5, PE6, PE7, PE8, PE9, PE10, PE11, PE12, NRST, FMINR, FMINL, MICIN, LINL, HPR, HPL, HPCOM, HPCOMFB, TVOUT, TVN0, TVN1, LRADC0

### Nets
5V: P1.30 P2.1 ; port VUSB
GND: P1.2 P1.29 P2.2 P2.29
3V3: P1.1 P2.30 ; port Power.3V3
FMINL: P1.10 ; port GPIO.FMINL
FMINR: P1.9 ; port GPIO.FMINR
HPCOM: P1.3 ; port GPIO.HPCOM
HPCOMFB: P1.4 ; port GPIO.HPCOMFB
HPL: P1.5 ; port GPIO.HPL
HPR: P1.6 ; port GPIO.HPR
LINL: P1.8 ; port GPIO.LINL
LRADC0: P1.11 ; port GPIO.LRADC0
MICIN: P1.7 ; port GPIO.MICIN
PA0: P1.15 ; port GPIO.PA0
PA1: P1.16 ; port GPIO.PA1
PA2: P1.17 ; port GPIO.PA2
PA3: P1.18 ; port GPIO.PA3
PD0: P2.3 ; port GPIO.PD0
PD1: P2.4 ; port GPIO.PD1
PD2: P2.5 ; port GPIO.PD2
PD3: P2.6 ; port GPIO.PD3
PD4: P2.7 ; port GPIO.PD4
PD5: P2.8 ; port GPIO.PD5
PD6: P2.9 ; port GPIO.PD6
PD7: P2.10 ; port GPIO.PD7
PD8: P2.11 ; port GPIO.PD8
PD9: P2.12 ; port GPIO.PD9
PD10: P2.13 ; port GPIO.PD10
PD11: P2.14 ; port GPIO.PD11
PD12: P2.15 ; port GPIO.PD12
PD13: P2.16 ; port GPIO.PD13
PD14: P2.17 ; port GPIO.PD14
PD15: P2.18 ; port GPIO.PD15
PD16: P2.19 ; port GPIO.PD16
PD17: P2.20 ; port GPIO.PD17
PD18: P2.21 ; port GPIO.PD18
PD19: P2.22 ; port GPIO.PD19
PD20: P2.23 ; port GPIO.PD20
PD21: P2.24 ; port GPIO.PD21
PE0: P1.19 ; port GPIO.PE0  [project net CP2102_TXD]
PE1: P1.20 ; port GPIO.PE1  [project net CP2102_RXD]
PE2: P1.21 ; port GPIO.PE2  [project net AWUSB_ID]
PE3: P1.22 ; port GPIO.PE3
PE4: P1.23 ; port GPIO.PE4
PE5: P1.24 ; port GPIO.PE5
PE6: P2.25 ; port GPIO.PE6
PE7: P1.25 ; port GPIO.PE7
PE8: P1.26 ; port GPIO.PE8
PE9: P1.27 ; port GPIO.PE9
PE10: P1.28 ; port GPIO.PE10
PE11: P2.26 ; port GPIO.PE11
PE12: P2.27 ; port GPIO.PE12
Reset: P2.28 ; port GPIO.NRST  [project net CP2102_DTR]
TVN0: P1.12 ; port GPIO.TVN0
TVN1: P1.13 ; port GPIO.TVN1
TVOUT: P1.14 ; port GPIO.TVOUT

### Notes on the sheet
- Candy
  F1C100S
- Title
- Size:
- Date:
- A4
- Number:
- Time:
- Revision:
- Sheet
- of
- File:

### Library data of the parts
P1 P2 = Header 30: Header, 30-Pin; LatestRevisionDate: 17-Jul-2002; LatestRevisionNote: Re-released for DXP Platform.; Publisher: Altium Limited

## Sheet debug.SchDoc
size A4; Organization: Altium Limited; Address1: L3, 12a Rodborough Rd; Address2: Frenchs Forest; Address3: NSW; Address4: Australia 2086
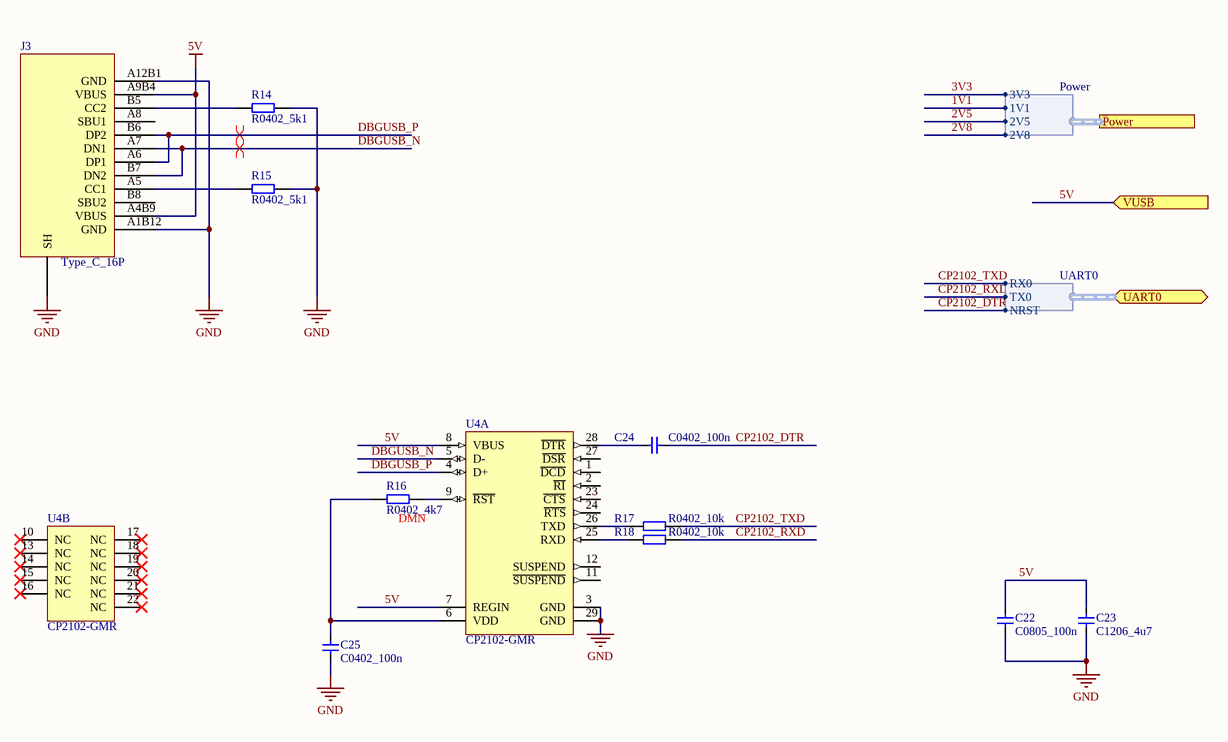
[diagram p7: debug.SchDoc]

### Parts
C22  C0805_100n  [C0805]
C23  C1206_4u7  [C1206]
C24  C0402_100n  [C0402]
C25  C0402_100n  [C0402]
J3  Type_C_16P  [Type_C_16P]
R14  R0402_5k1  [R0402]
R15  R0402_5k1  [R0402]
R16  R0402_4k7  [R0402]
R17  R0402_10k  [R0402]
R18  R0402_10k  [R0402]
U4  CP2102-GMR  [SLAB-QFN-28-3125x3125TP_M]  (parts A,B of 2)

### Ports
Power (harness Power), UART0 (bidir, harness UART0), VUSB (in)

### Harnesses
Power: 3V3, 1V1, 2V5, 2V8
UART0: RX0, TX0, NRST

### Nets
5V: C22.1 C23.1 J3.A4B9(VBUS) J3.A9B4(VBUS) U4.7(REGIN) U4.8(VBUS) ; port VUSB
GND: C22.2 C23.2 C25.2 J3.0(SH) J3.A1B12(GND) J3.A12B1(GND) R14.2 R15.2 U4.3(GND) U4.29(GND)
CP2102_DTR: C24.2 ; port UART0.NRST
CP2102_RXD: R18.2 ; port UART0.TX0
CP2102_TXD: R17.2 ; port UART0.RX0
DBGUSB_N: J3.A7(DN1) J3.B7(DN2) U4.5(D-)
DBGUSB_P: J3.A6(DP1) J3.B6(DP2) U4.4(D+)
NetC24_1: C24.1 U4.28(~{DTR})
NetC25_1: C25.1 R16.1 U4.6(VDD)
NetJ3_A5: J3.A5(CC1) R15.1
NetJ3_B5: J3.B5(CC2) R14.1
NetR16_2: R16.2 U4.9(~{RST})
NetR17_1: R17.1 U4.26(TXD)
NetR18_1: R18.1 U4.25(RXD)

Not connected (* = marked no-connect by the designer): J3 A8(SBU1) B8(SBU2); U4 1(~{DCD}) 2(~{RI}) 10(NC)* 11(~{SUSPEND}) 12(SUSPEND) 13(NC)* 14(NC)* 15(NC)* 16(NC)* 17(NC)* 18(NC)* 19(NC)* 20(NC)* 21(NC)* 22(NC)* 23(~{CTS}) 24(~{RTS}) 27(~{DSR})

### Layout directives
differential pair: DBGUSB_N, DBGUSB_P

### Notes on the sheet
- (near R16) DMN
- Title
- Size:
- Date:
- A4
- Number:
- Time:
- Revision:
- Sheet
- of
- File:

### Library data of the parts
C22 = CMP-003-0073-1: Manufacturer 1: Kemet; Manufacturer Part Number 1: C0805C104K3RAC; Dielectric: X7R; Value: 100n; Tolerance: 0.1%; Voltage Rating DC: 25V; Hidden Value: C104; Component Type: Standard; Part Number: C0805_100n; Pin Count: 2
C23 = CMP-003-0093-1: as C26 on sheet power; Component Type: Standard; Part Number: C1206_4u7; Pin Count: 2
C24 C25 = CMP-003-0006-1: as C1 on sheet soc; Part Number: C0402_100n; Pin Count: 2; Component Type: Standard
R14 R15 = CMP-004-0436-1: as R23 on sheet power; Pin Count: 2; Component Type: Standard; Part Number: R0402_5k1
R16 = CMP-004-0435-1: Manufacturer Part Number 1: CRCW04024K70FKED; Manufacturer 1: Vishay; Tolerance: 1%; Power Rating: 62,5mW; Value: 4k7; Pin Count: 2; Component Type: Standard; Part Number: R0402_4k7
R17 R18 = CMP-004-0443-1: as R6 on sheet flash; Part Number: R0402_10k; Component Type: Standard; Pin Count: 2
U4 = CMP-2000-04924-1: Single-Chip USB to URAT Bridge, 3.3 V, -40 to 85 degC, 28-Pin QFN, RoHS, Tape and Reel; Manufacturer: Silicon Labs; Interface Circuit Standard 1: RS-232; Transmitter and Receiver FIFO Counter: No; Supply Current: 26mA; Operating Supply Voltage (Min): 3V; Operating Supply Voltage (Typ): 3.3V; Data Rate: 1000kbps; Operating Supply Voltage (Max): 3.6V; Number of Channels: 1; Package URL: http://www.silabs.com/Support%20Documents/TechnicalDocs/C8051T61x.pdf; Operating Temperature (Max): 85C; Datasheet URL: http://www.mouser.com/ds/2/368/CP2102-9-247052.pdf; Operating Temperature Classification: Industrial; Operating Temperature (Min): -40C; Package Description: 28-Pin Quad-Flat No-Leads Package, Body 5 x 5 mm, Pitch 0.5 mm; Manufacturer URL: http://www.silabs.com/; Rad Hardened: No; Package Reference: QFN-28; Pin Count: 28; Packaging: TapeandReel; Mounting: SurfaceMount; Package Type: QFNEP; Datasheet Version: Rev. 1.6, 12/2013

## Nets that join several sheets
5V: power (12 pins), usb (J2.A4B9 J2.A9B4), gpio (P1.30 P2.1), debug (6 pins)
GND: soc (29 pins), power (24 pins), usb (8 pins), flash (U2.4), sdcard (C21.2 J1.G1 J1.G2 J1.P6), gpio (P1.2 P1.29 P2.2 P2.29), debug (10 pins)
1V1: soc (6 pins), power (5 pins)
2V5: soc (9 pins), power (5 pins)
2V8: soc (U1.80), power (5 pins)
3V3: soc (12 pins), power (5 pins), usb (C42.1 U9.1 U9.3), flash (R6.2 U2.3 U2.7 U2.8), sdcard (7 pins), gpio (P1.1 P2.30)
AWUSB_ID: soc (U1.47), usb (R31.1 R32.1), gpio (P1.21)
AWUSB_N: soc (U1.68), usb (J2.A7 J2.B7)
AWUSB_P: soc (U1.69), usb (J2.A6 J2.B6)
CP2102_DTR: soc (5 pins), gpio (P2.28), debug (C24.2)
CP2102_RXD: soc (U1.48), gpio (P1.20), debug (R18.2)
CP2102_TXD: soc (U1.49), gpio (P1.19), debug (R17.2)
FMINL: soc (U1.84), gpio (P1.10)
FMINR: soc (U1.85), gpio (P1.9)
HPCOM: soc (U1.3), gpio (P1.3)
HPCOMFB: soc (U1.2), gpio (P1.4)
HPL: soc (U1.1), gpio (P1.5)
HPR: soc (U1.88), gpio (P1.6)
LINL: soc (U1.86), gpio (P1.8)
LRADC0: soc (U1.79), gpio (P1.11)
MICIN: soc (U1.87), gpio (P1.7)
PA0: soc (U1.66), gpio (P1.15)
PA1: soc (U1.65), gpio (P1.16)
PA2: soc (U1.64), gpio (P1.17)
PA3: soc (U1.63), gpio (P1.18)
PD0: soc (U1.6), gpio (P2.3)
PD1: soc (U1.7), gpio (P2.4)
PD2: soc (U1.8), gpio (P2.5)
PD3: soc (U1.9), gpio (P2.6)
PD4: soc (U1.10), gpio (P2.7)
PD5: soc (U1.11), gpio (P2.8)
PD6: soc (U1.12), gpio (P2.9)
PD7: soc (U1.13), gpio (P2.10)
PD8: soc (U1.14), gpio (P2.11)
PD9: soc (U1.15), gpio (P2.12)
PD10: soc (U1.16), gpio (P2.13)
PD11: soc (U1.17), gpio (P2.14)
PD12: soc (U1.18), gpio (P2.15)
PD13: soc (U1.19), gpio (P2.16)
PD14: soc (U1.21), gpio (P2.17)
PD15: soc (U1.23), gpio (P2.18)
PD16: soc (U1.24), gpio (P2.19)
PD17: soc (U1.25), gpio (P2.20)
PD18: soc (U1.26), gpio (P2.21)
PD19: soc (U1.27), gpio (P2.22)
PD20: soc (U1.28), gpio (P2.23)
PD21: soc (U1.29), gpio (P2.24)
PE3: soc (U1.46), gpio (P1.22)
PE4: soc (U1.45), gpio (P1.23)
PE5: soc (U1.44), gpio (P1.24)
PE6: soc (U1.43), gpio (P2.25)
PE7: soc (U1.42), gpio (P1.25)
PE8: soc (U1.41), gpio (P1.26)
PE9: soc (U1.40), gpio (P1.27)
PE10: soc (U1.39), gpio (P1.28)
PE11: soc (U1.38), gpio (P2.26)
PE12: soc (U1.37), gpio (P2.27)
SDC0_CLK: soc (U1.56), sdcard (J1.P5)
SDC0_CMD: soc (U1.55), sdcard (J1.P3 R9.1)
SDC0_D0: soc (U1.57), sdcard (J1.P7 R10.1)
SDC0_D1: soc (U1.58), sdcard (J1.P8 R11.1)
SDC0_D2: soc (U1.53), sdcard (J1.P1 R12.1)
SDC0_D3: soc (U1.54), sdcard (J1.P2 R13.1)
SPI0_CLK: soc (U1.59), flash (U2.6)
SPI0_CS: soc (U1.60), flash (R6.1 U2.1)
SPI0_MISO: soc (U1.61), flash (U2.2)
SPI0_MOSI: soc (U1.62), flash (U2.5)
TVN0: soc (U1.78), gpio (P1.12)
TVN1: soc (U1.77), gpio (P1.13)
TVOUT: soc (U1.72), gpio (P1.14)